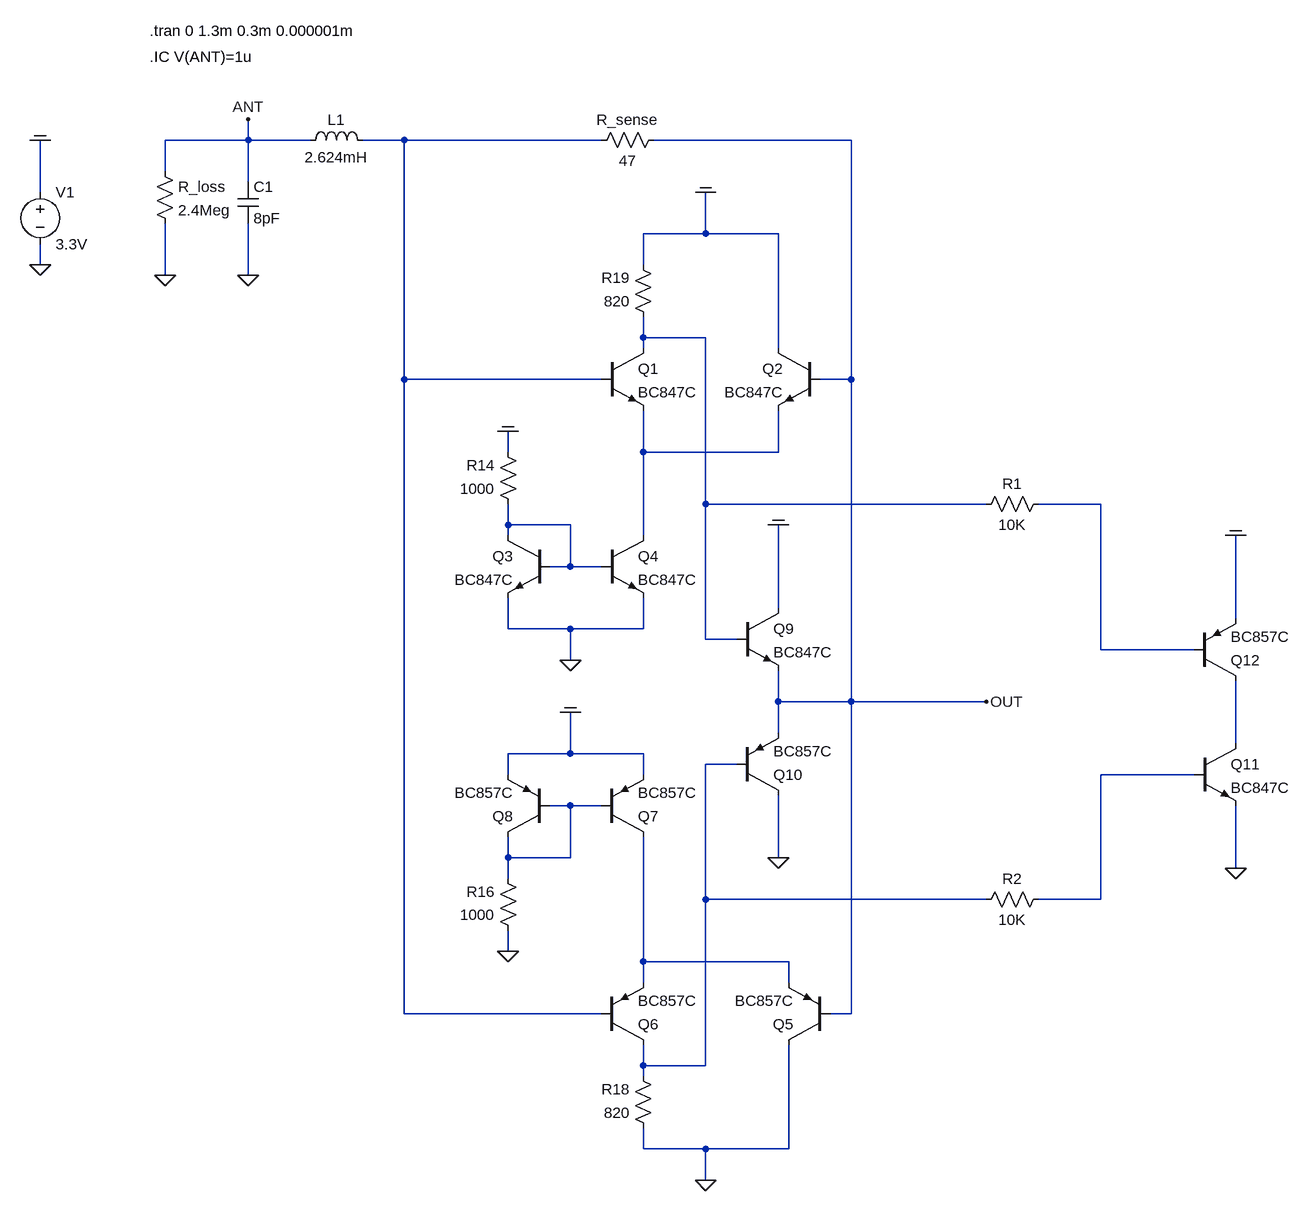
[diagram p0: schematic 2020_current_sense_comparator_npn_pnp_v01.asc]
2020_current_sense_comparator_npn_pnp_v01.asc, the LTspice schematic file:
Version 4
SHEET 1 3920 3748
WIRE -576 480 -576 448
WIRE -576 480 -704 480
WIRE -480 480 -576 480
WIRE -336 480 -400 480
WIRE -32 480 -336 480
WIRE 352 480 48 480
WIRE -704 528 -704 480
WIRE -576 544 -576 480
WIRE -896 560 -896 480
WIRE 128 624 128 560
WIRE 128 624 32 624
WIRE 240 624 128 624
WIRE -896 672 -896 640
WIRE 32 672 32 624
WIRE -704 688 -704 608
WIRE -576 688 -576 608
WIRE 32 784 32 752
WIRE 128 784 32 784
WIRE 32 800 32 784
WIRE 240 800 240 624
WIRE -336 848 -336 480
WIRE -32 848 -336 848
WIRE 352 848 352 480
WIRE 352 848 304 848
WIRE -176 960 -176 928
WIRE 32 960 32 896
WIRE 240 960 240 896
WIRE 240 960 32 960
WIRE 128 1040 128 784
WIRE 560 1040 128 1040
WIRE 736 1040 640 1040
WIRE -176 1072 -176 1040
WIRE -80 1072 -176 1072
WIRE -176 1088 -176 1072
WIRE 32 1088 32 960
WIRE -80 1136 -80 1072
WIRE -80 1136 -112 1136
WIRE -32 1136 -80 1136
WIRE 240 1200 240 1072
WIRE 944 1216 944 1088
WIRE -176 1232 -176 1184
WIRE -80 1232 -176 1232
WIRE 32 1232 32 1184
WIRE 32 1232 -80 1232
WIRE 128 1248 128 1040
WIRE 176 1248 128 1248
WIRE 736 1264 736 1040
WIRE 880 1264 736 1264
WIRE -80 1280 -80 1232
WIRE 240 1344 240 1296
WIRE 352 1344 352 848
WIRE 352 1344 240 1344
WIRE 560 1344 352 1344
WIRE 240 1392 240 1344
WIRE 944 1408 944 1312
WIRE -80 1424 -80 1360
WIRE -80 1424 -176 1424
WIRE 32 1424 -80 1424
WIRE 176 1440 128 1440
WIRE -176 1456 -176 1424
WIRE 32 1456 32 1424
WIRE 880 1456 736 1456
WIRE -80 1504 -112 1504
WIRE -32 1504 -80 1504
WIRE -176 1584 -176 1552
WIRE -80 1584 -80 1504
WIRE -80 1584 -176 1584
WIRE 240 1584 240 1488
WIRE 944 1600 944 1504
WIRE -176 1616 -176 1584
WIRE 128 1648 128 1440
WIRE 560 1648 128 1648
WIRE 736 1648 736 1456
WIRE 736 1648 640 1648
WIRE -176 1728 -176 1696
WIRE 32 1744 32 1552
WIRE 256 1744 32 1744
WIRE 32 1776 32 1744
WIRE 256 1776 256 1744
WIRE -336 1824 -336 848
WIRE -32 1824 -336 1824
WIRE 352 1824 352 1344
WIRE 352 1824 320 1824
WIRE 32 1904 32 1872
WIRE 128 1904 128 1648
WIRE 128 1904 32 1904
WIRE 32 1920 32 1904
WIRE 32 2032 32 2000
WIRE 128 2032 32 2032
WIRE 256 2032 256 1872
WIRE 256 2032 128 2032
WIRE 128 2080 128 2032
FLAG -896 672 0
FLAG -896 480 COM
FLAG -576 688 0
FLAG -576 448 ANT
FLAG -704 688 0
FLAG -80 1280 0
FLAG 128 560 COM
FLAG -176 928 COM
FLAG -80 1360 COM
FLAG 128 2080 0
FLAG -176 1728 0
FLAG 240 1072 COM
FLAG 240 1584 0
FLAG 560 1344 OUT
FLAG 944 1088 COM
FLAG 944 1600 0
SYMBOL voltage -896 544 R0
WINDOW 123 0 0 Left 0
WINDOW 39 0 0 Left 0
SYMATTR InstName V1
SYMATTR Value 3.3V
SYMBOL ind -496 496 R270
WINDOW 0 32 56 VTop 2
WINDOW 3 5 56 VBottom 2
SYMATTR InstName L1
SYMATTR Value 2.624mH
SYMATTR SpiceLine Rser=66 Rpar=10Meg Cpar=1.216pF
SYMBOL cap -592 544 R0
SYMATTR InstName C1
SYMATTR Value 8pF
SYMBOL res -720 512 R0
SYMATTR InstName R_loss
SYMATTR Value 2.4Meg
SYMBOL res 64 464 R90
WINDOW 0 0 56 VBottom 2
WINDOW 3 32 56 VTop 2
SYMATTR InstName R_sense
SYMATTR Value 47
SYMBOL npn -32 800 R0
SYMATTR InstName Q1
SYMATTR Value BC847C
SYMBOL npn 304 800 M0
SYMATTR InstName Q2
SYMATTR Value BC847C
SYMBOL npn -112 1088 M0
SYMATTR InstName Q3
SYMATTR Value BC847C
SYMBOL npn -32 1088 R0
SYMATTR InstName Q4
SYMATTR Value BC847C
SYMBOL res -160 1056 R180
WINDOW 0 36 76 Left 2
WINDOW 3 36 40 Left 2
SYMATTR InstName R14
SYMATTR Value 1000
SYMBOL pnp 320 1872 R180
SYMATTR InstName Q5
SYMATTR Value BC857C
SYMBOL pnp -32 1872 M180
SYMATTR InstName Q6
SYMATTR Value BC857C
SYMBOL pnp -32 1552 M180
SYMATTR InstName Q7
SYMATTR Value BC857C
SYMBOL pnp -112 1552 R180
SYMATTR InstName Q8
SYMATTR Value BC857C
SYMBOL res -160 1712 R180
WINDOW 0 36 76 Left 2
WINDOW 3 36 40 Left 2
SYMATTR InstName R16
SYMATTR Value 1000
SYMBOL res 48 2016 R180
WINDOW 0 36 76 Left 2
WINDOW 3 36 40 Left 2
SYMATTR InstName R18
SYMATTR Value 820
SYMBOL res 48 768 R180
WINDOW 0 36 76 Left 2
WINDOW 3 36 40 Left 2
SYMATTR InstName R19
SYMATTR Value 820
SYMBOL npn 176 1200 R0
SYMATTR InstName Q9
SYMATTR Value BC847C
SYMBOL pnp 176 1488 M180
SYMATTR InstName Q10
SYMATTR Value BC857C
SYMBOL npn 880 1408 R0
SYMATTR InstName Q11
SYMATTR Value BC847C
SYMBOL pnp 880 1312 M180
SYMATTR InstName Q12
SYMATTR Value BC857C
SYMBOL res 544 1056 R270
WINDOW 0 32 56 VTop 2
WINDOW 3 0 56 VBottom 2
SYMATTR InstName R1
SYMATTR Value 10K
SYMBOL res 544 1664 R270
WINDOW 0 32 56 VTop 2
WINDOW 3 0 56 VBottom 2
SYMATTR InstName R2
SYMATTR Value 10K
TEXT -728 312 Left 2 !.tran 0 1.3m 0.3m 0.000001m
TEXT -728 352 Left 2 !.IC V(ANT)=1u

The netlist it stands for:
* 2020_current_sense_comparator_npn_pnp_v01.asc
V1 COM 0 3.3V
L1 ANT N001 2.624mH Rser=66 Rpar=10Meg Cpar=1.216pF
C1 ANT 0 8pF
R_loss ANT 0 2.4Meg
R_sense OUT N001 47
Q1 N002 N001 N003 0 BC847C
Q2 COM OUT N003 0 BC847C
Q3 N005 N005 0 0 BC847C
Q4 N003 N005 0 0 BC847C
R14 N005 COM 1000
Q5 0 OUT N010 0 BC857C
Q6 N007 N001 N010 0 BC857C
Q7 N010 N009 COM 0 BC857C
Q8 N009 N009 COM 0 BC857C
R16 0 N009 1000
R18 0 N007 820
R19 N002 COM 820
Q9 COM N002 OUT 0 BC847C
Q10 0 N007 OUT 0 BC857C
Q11 N006 N008 0 0 BC847C
Q12 N006 N004 COM 0 BC857C
R1 N002 N004 10K
R2 N007 N008 10K
.model NPN NPN
.model PNP PNP
.lib standard.bjt
.tran 0 1.3m 0.3m 0.000001m
.IC V(ANT)=1u
.backanno
.end